# Altium schematic sheet Task0301.SchDoc
size A4; PageSetup: Record=PageOptions?CenterHorizontal=True?CenterVertical=True?PrintScale=1.00?XCorrection=1.00?YCorrection=1.00?PrintKind=0?BorderSize=5000000?LeftOffset=0?BottomOffset=0?Orientation=2?PaperLength=1000?PaperWidth=1000?Scale=100?PaperSource=7?PrintQuality=-4?MediaType=1?DitherType=10?PaperKind=A4?PrintScaleMode=1
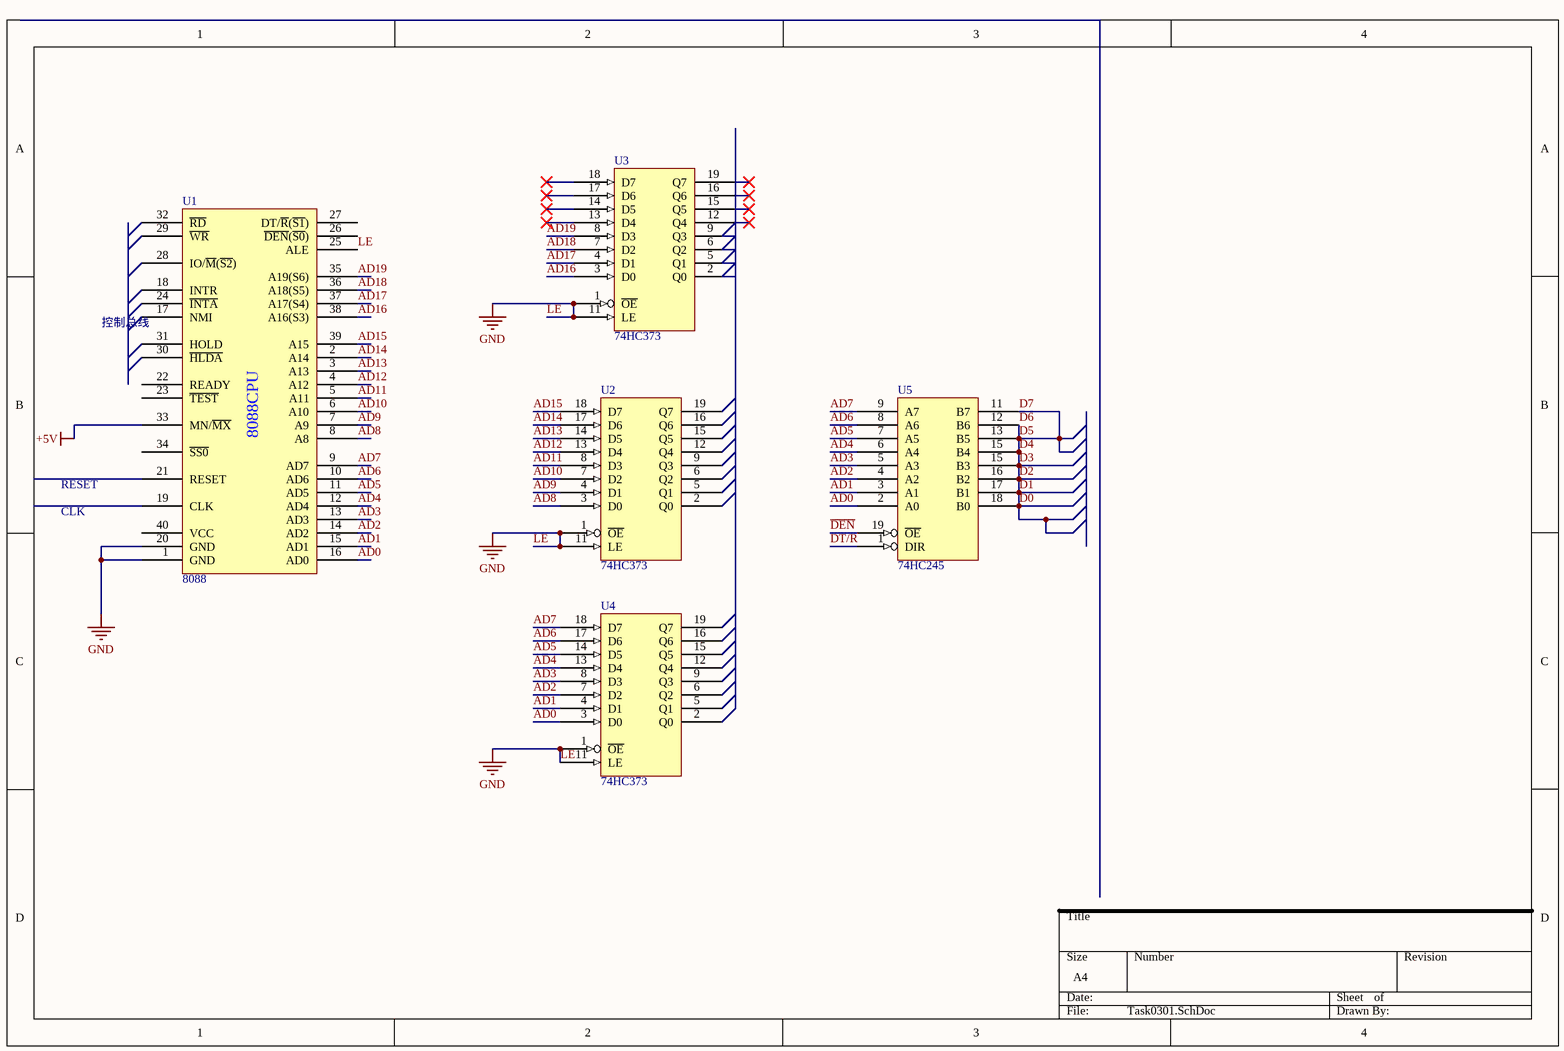
[diagram p0: Task0301.SchDoc]

## Parts
U1  8088
U2  74HC373
U3  74HC373
U4  74HC373
U5  74HC245

## Nets
+5V: U1.33(MN/~{MX})
LE: U1.1(GND) U1.20(GND) U1.25(ALE) U2.1(~{OE}) U2.11(LE) U3.1(~{OE}) U3.11(LE) U4.1(~{OE}) U4.11(LE)  [also labelled GND]
AD0: U1.16(AD0) U4.3(D0) U5.2(A0)
AD1: U1.15(AD1) U4.4(D1) U5.3(A1)
AD2: U1.14(AD2) U4.7(D2) U5.4(A2)
AD3: U1.13(AD3) U4.8(D3) U5.5(A3)
AD4: U1.12(AD4) U4.13(D4) U5.6(A4)
AD5: U1.11(AD5) U4.14(D5) U5.7(A5)
AD6: U1.10(AD6) U4.17(D6) U5.8(A6)
AD7: U1.9(AD7) U4.18(D7) U5.9(A7)
AD8: U1.8(A8) U2.3(D0)
AD9: U1.7(A9) U2.4(D1)
AD10: U1.6(A10) U2.7(D2)
AD11: U1.5(A11) U2.8(D3)
AD12: U1.4(A12) U2.13(D4)
AD13: U1.3(A13) U2.14(D5)
AD14: U1.2(A14) U2.17(D6)
AD15: U1.39(A15) U2.18(D7)
AD16: U1.38(A16(S3)) U3.3(D0)
AD17: U1.37(A17(S4)) U3.4(D1)
AD18: U1.36(A18(S5)) U3.7(D2)
AD19: U1.35(A19(S6)) U3.8(D3)
D0: U5.11(B7) U5.12(B6) U5.13(B5) U5.15(B3) U5.16(B2) U5.17(B1) U5.18(B0)  [also labelled D1, D2, D3, D4, D5, D6, D7]
~{DEN}: U5.19(~{OE})
DT/~{R}: U5.1(DIR)

Not connected (* = marked no-connect by the designer): U1 17(NMI) 18(INTR) 19(CLK) 21(RESET) 22(READY) 23(~{TEST}) 24(~{INTA}) 26(~{DEN}(~{S0})) 27(DT/~{R}(~{S1})) 28(IO/~{M}(~{S2})) 29(~{WR}) 30(~{HLDA}) 31(HOLD) 32(~{RD}) 34(~{SS0}) 40(VCC); U2 2(Q0) 5(Q1) 6(Q2) 9(Q3) 12(Q4) 15(Q5) 16(Q6) 19(Q7); U3 2(Q0) 5(Q1) 6(Q2) 9(Q3) 12(Q4)* 13(D4)* 14(D5)* 15(Q5)* 16(Q6)* 17(D6)* 18(D7)* 19(Q7)*; U4 2(Q0) 5(Q1) 6(Q2) 9(Q3) 12(Q4) 15(Q5) 16(Q6) 19(Q7)

## Notes on the sheet
- 控制总线
- RESET
- CLK
- (in symbol 8088) 8088CPU